# Altium schematic sheet Monitait.SchDoc
size 762 x 508 mm
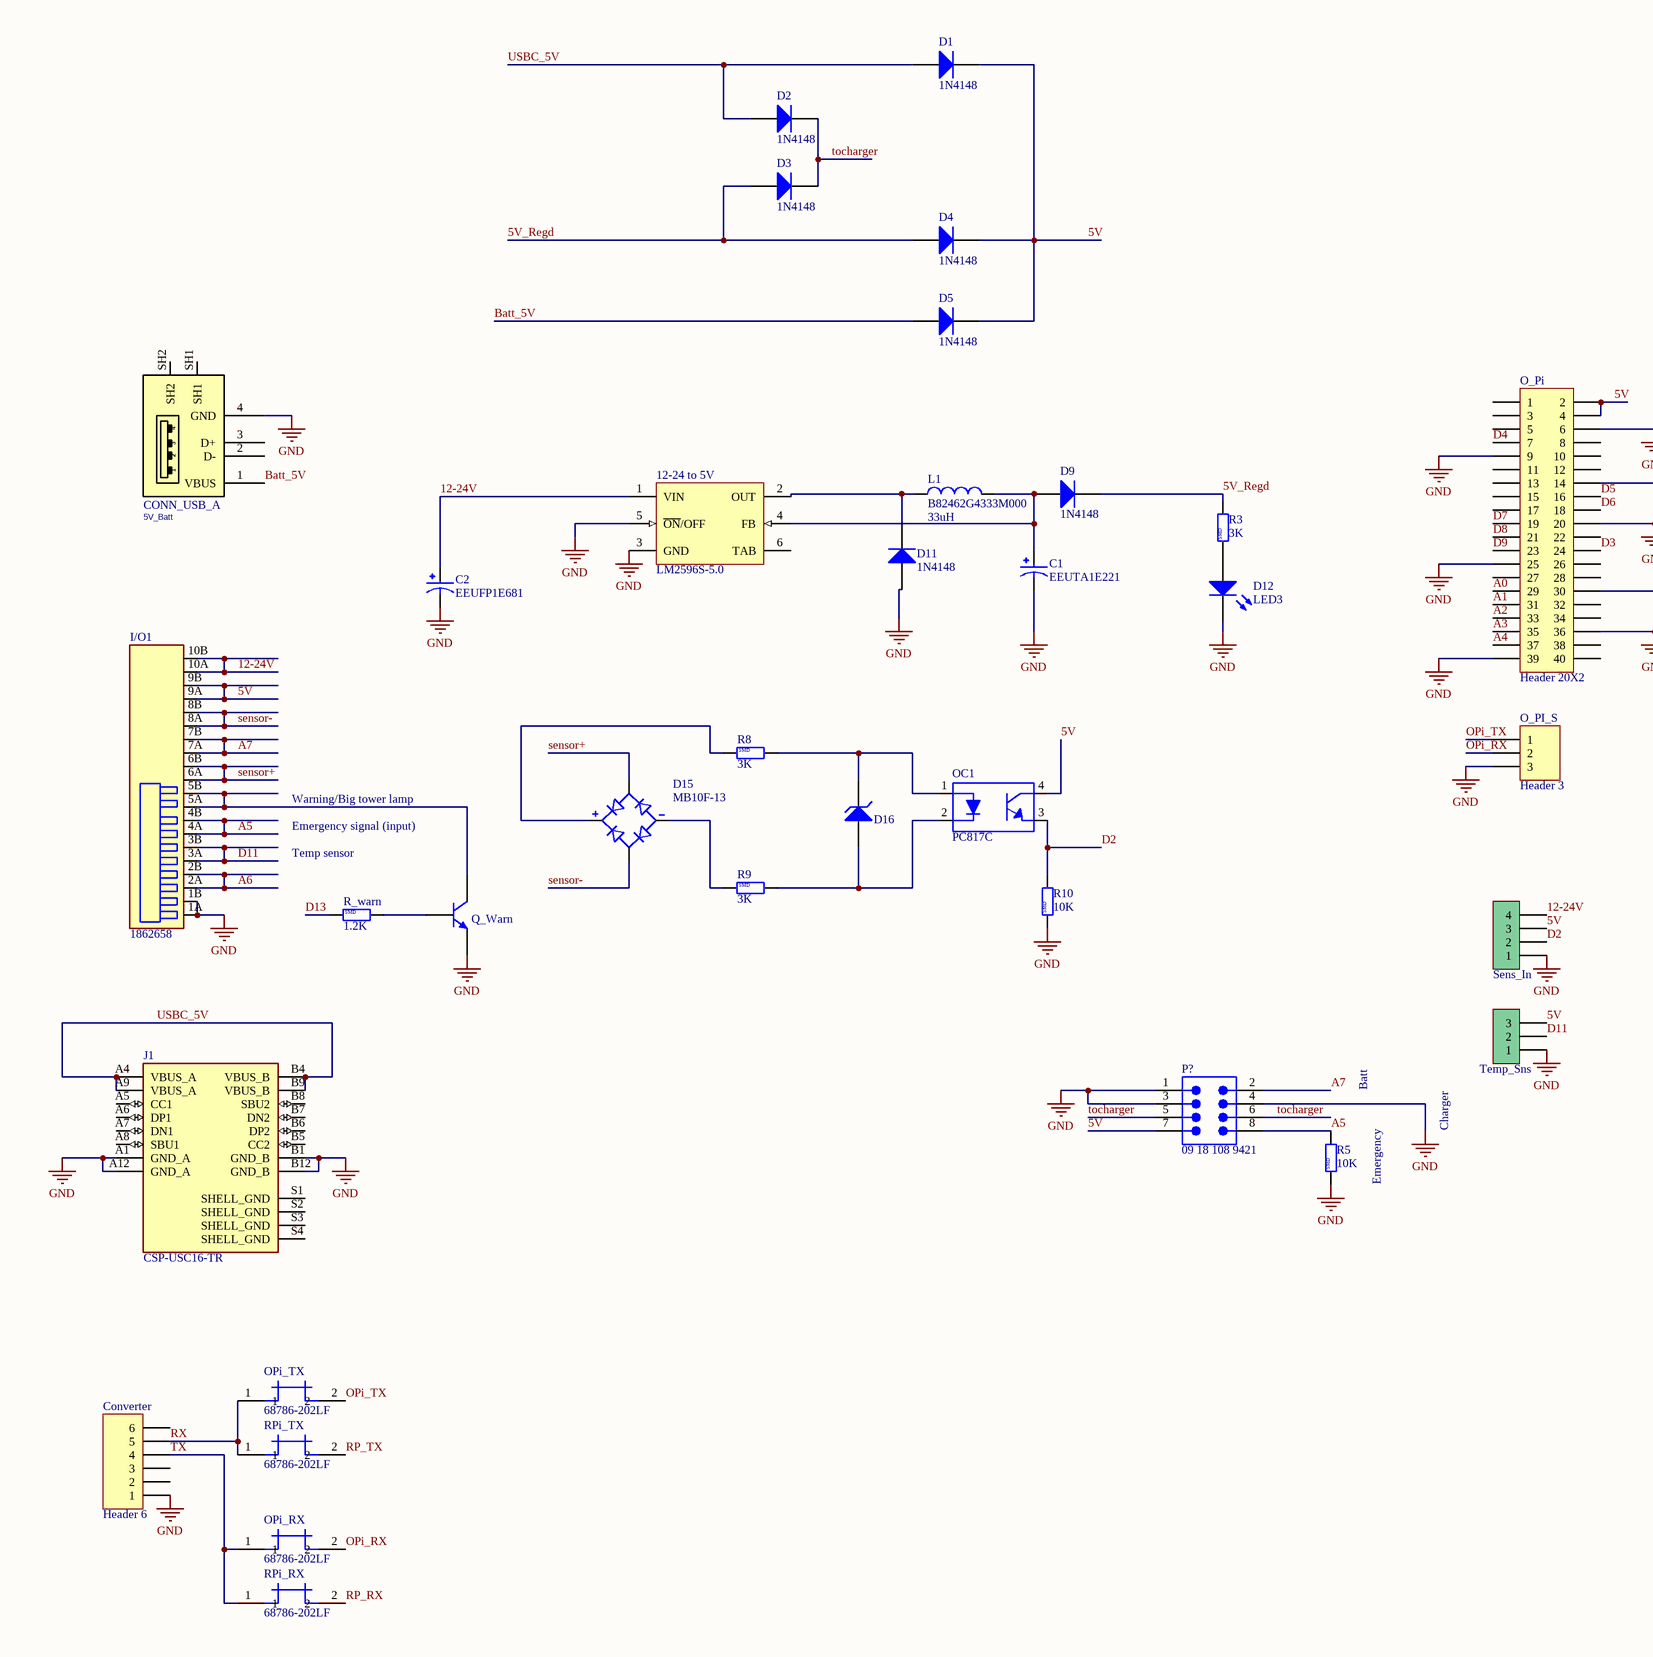
[diagram p0: Monitait.SchDoc, left]
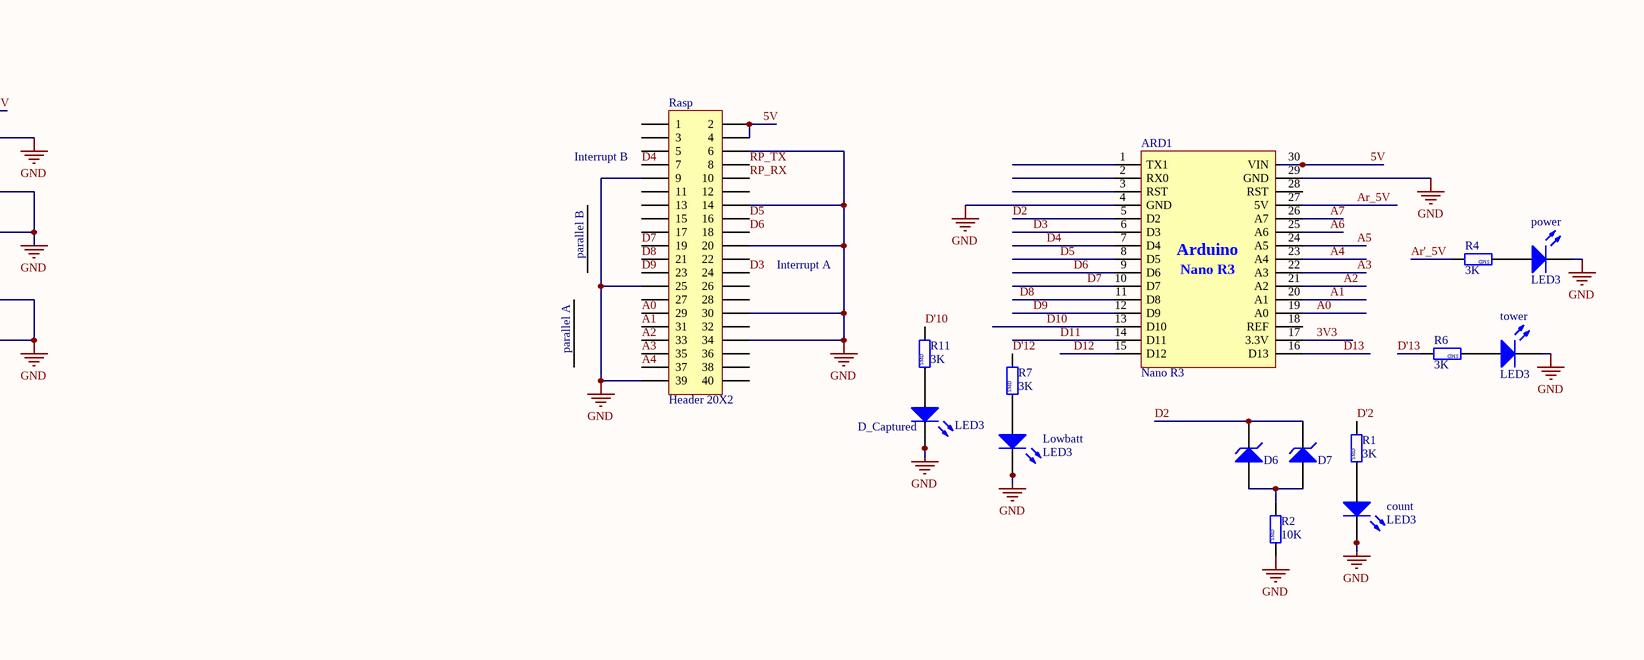
[diagram p1: Monitait.SchDoc, right]

## Parts
5V_Batt  CONN_USB_A  [USB_A_REC_ST]
12-24_to_5V  LM2596S-5.0  [TS5B_N]
ARD1  Nano R3  [Arduino_Nano_R3]
C1  EEUTA1E221  [CAPPRD500W60D1000H1250]
C2  EEUFP1E681  [CAPPRD500W60D1000H1600]
Converter  Header 6  [HDR1X6]
count  LED3  [RES 0805 (2012X06L)]
D1  1N4148  [LL4148]
D2  1N4148  [LL4148]
D3  1N4148  [LL4148]
D4  1N4148  [LL4148]
D5  1N4148  [LL4148]
D6  Diode Zener  [MINI MELF]  (value not drawn)
D7  Diode Zener  [Diode 1W]  (value not drawn)
D9  1N4148  [LL4148]
D11  1N4148  [LL4148]
D12  LED3  [RES 0805 (2012X06L)]
D15  MB10F-13  [DIOB_MB10F-13]
D16  Diode Zener  [MINI MELF]  (value not drawn)
D_Captured  LED3  [RES 0805 (2012X06L)]
I/O1  1862658  [PHOENIX_1862658]
J1  CSP-USC16-TR  [VALCON_CSP-USC16-TR]
L1  B82462G4333M000  value 33uH  [B82462G4]
Lowbatt  LED3  [RES 0805 (2012X06L)]
O_Pi  Header 20X2  [HDR2X20]
O_PI_S  Header 3  [HDR1X3]
OC1  PC817C  [SOP4]
OPi_RX  68786-202LF  [HDR1X2]
OPi_TX  68786-202LF  [HDR1X2]
P?  09 18 108 9421  [9181089421]
power  LED3  [RES 0805 (2012X06L)]
Q_Warn  BD135-37-39  [TO-126 (SOT32) Gold PCB]  (value not drawn)
R1  3K  [RES 0805 (2012X06L)]
R2  10K  [RES 0805 (2012X06L)]
R3  3K  [RES 0805 (2012X06L)]
R4  3K  [RES 0805 (2012X06L)]
R5  10K  [RES 0805 (2012X06L)]
R6  3K  [RES 0805 (2012X06L)]
R7  3K  [RES 0805 (2012X06L)]
R8  3K  [RES 0805 (2012X06L)]
R9  3K  [RES 0805 (2012X06L)]
R10  10K  [RES 0805 (2012X06L)]
R11  3K  [RES 0805 (2012X06L)]
R_warn  1.2K  [RES 0805 (2012X06L)]
Rasp  Header 20X2  [HDR2X20]
RPi_RX  68786-202LF  [HDR1X2]
RPi_TX  68786-202LF  [HDR1X2]
Sens_In  Phoenix terminal  [phoenix terminal 4]  (value not drawn)
Temp_Sns  Phoenix terminal  [phoenix terminal 3]  (value not drawn)
tower  LED3  [RES 0805 (2012X06L)]

## Nets
GND: 5V_Batt.4(GND) 12-24_to_5V.3(GND) 12-24_to_5V.5(~{ON}/OFF) ARD1.4(GND) ARD1.29(GND) C1.N C2.N Converter.1 count.2(K) D11.1(A) D12.2(K) D_Captured.2(K) I/O1.1A I/O1.1B J1.A1(GND_A) J1.A12(GND_A) J1.B1(GND_B) J1.B12(GND_B) Lowbatt.2(K) O_Pi.6 O_Pi.9 O_Pi.14 O_Pi.20 O_Pi.25 O_Pi.30 O_Pi.36 O_Pi.39 O_PI_S.3 P?.1 P?.3 P?.4 power.2(K) Q_Warn.1(E) R2.1 R5.1 R10.1 Rasp.6 Rasp.9 Rasp.14 Rasp.20 Rasp.25 Rasp.30 Rasp.34 Rasp.39 Sens_In.1 Temp_Sns.1 tower.2(K)
3V3: ARD1.17(3.3V)
5V: ARD1.30(VIN) D1.2(K) D4.2(K) D5.2(K) I/O1.9A I/O1.9B O_Pi.2 O_Pi.4 OC1.4 P?.7 Rasp.2 Rasp.4 Sens_In.3 Temp_Sns.3
5V_Regd: D3.1(A) D4.1(A) D9.2(K) R3.2
12-24V: 12-24_to_5V.1(VIN) C2.P I/O1.10A I/O1.10B Sens_In.4
A0: ARD1.19(A0) O_Pi.29 Rasp.29
A1: ARD1.20(A1) O_Pi.31 Rasp.31
A2: ARD1.21(A2) O_Pi.33 Rasp.33
A3: ARD1.22(A3) O_Pi.35 Rasp.35
A4: ARD1.23(A4) O_Pi.37 Rasp.37
A5: ARD1.24(A5) I/O1.4A I/O1.4B P?.8 R5.2
A6: ARD1.25(A6) I/O1.2A I/O1.2B
A7: ARD1.26(A7) I/O1.7A I/O1.7B P?.2
Ar'_5V: R4.2
Ar_5V: ARD1.27(5V)
Batt_5V: 5V_Batt.1(VBUS) D5.1(A)
D2: ARD1.5(D2) D6.2(K) D7.2(K) OC1.3 R10.2 Sens_In.2
D3: ARD1.6(D3) O_Pi.24 Rasp.24
D4: ARD1.7(D4) O_Pi.7 Rasp.7
D5: ARD1.8(D5) O_Pi.16 Rasp.16
D6: ARD1.9(D6) O_Pi.18 Rasp.18
D7: ARD1.10(D7) O_Pi.19 Rasp.19
D8: ARD1.11(D8) O_Pi.21 Rasp.21
D9: ARD1.12(D9) O_Pi.23 Rasp.23
D10: ARD1.13(D10)
D11: ARD1.14(D11) I/O1.3A I/O1.3B Temp_Sns.2
D12: ARD1.15(D12)
D13: ARD1.16(D13) R_warn.1
D'2: R1.2
D'10: R11.2
D'12: R7.2
D'13: R6.2
OPi_RX: O_PI_S.2 OPi_RX.2
OPi_TX: O_PI_S.1 OPi_TX.2
RP_RX: Rasp.10 RPi_RX.2
RP_TX: Rasp.8 RPi_TX.2
RX: Converter.5 OPi_TX.1 RPi_TX.1
sensor+: D15.2(AC1) I/O1.6A I/O1.6B
sensor-: D15.4(AC2) I/O1.8A I/O1.8B
tocharger: D2.2(K) D3.2(K) P?.5 P?.6
TX: Converter.4 OPi_RX.1 RPi_RX.1
USBC_5V: D1.1(A) D2.1(A) J1.A4(VBUS_A) J1.A9(VBUS_A) J1.B4(VBUS_B) J1.B9(VBUS_B)
Net12-24_to_5V_2: 12-24_to_5V.2(OUT) D11.2(K) L1.1
Net12-24_to_5V_4: 12-24_to_5V.4(FB) C1.P D9.1(A) L1.2
Netcount_1: count.1(A) R1.1
NetD6_1: D6.1(A) D7.1(A) R2.2
NetD12_1: D12.1(A) R3.1
NetD15_1: D15.1(POS) R8.1
NetD15_3: D15.3(NEG) R9.1
NetD16_1: D16.1(A) OC1.2 R9.2
NetD16_2: D16.2(K) OC1.1 R8.2
NetD_Captured_1: D_Captured.1(A) R11.1
NetI/O1_5A: I/O1.5A I/O1.5B Q_Warn.2(C)
NetLowbatt_1: Lowbatt.1(A) R7.1
Netpower_1: power.1(A) R4.1
NetQ_Warn_3: Q_Warn.3(B) R_warn.2
NetR6_1: R6.1 tower.1(A)

Not connected (* = marked no-connect by the designer): 5V_Batt 2(D-) 3(D+) SH1 SH2; 12-24_to_5V 6(TAB); ARD1 1(TX1) 2(RX0) 3(RST) 18(REF) 28(RST); Converter 2 3 6; J1 A5(CC1) A6(DP1) A7(DN1) A8(SBU1) B5(CC2) B6(DP2) B7(DN2) B8(SBU2) S1(SHELL_GND) S2(SHELL_GND) S3(SHELL_GND) S4(SHELL_GND); O_Pi 1 3 5 8 10 11 12 13 15 17 22 26 27 28 32 34 38 40; Rasp 1 3 5 11 12 13 15 17 22 26 27 28 32 36 38 40

## Notes on the sheet
- (near Rasp) Interrupt B
- parallel B
- Interrupt A
- parallel A
- Warning/Big tower lamp
- Emergency signal (input)
- Temp sensor
- Batt
- Charger
- (near R5) Emergency
- (in symbol Arduino Nano R3) Arduino
- (in symbol Resistor SMD) SMD

## Library data of the parts
5V_Batt = USB_A_REC_ST: CONN, USB, A, RECEPTACLE, STRAIGHT, THD; VALUE: CONN_USB_A
12-24_to_5V = LM2596S-5.0: SIMPLE SWITCHER® Power Converter 150 KHz 3A Step-Down Voltage Regulator, 5-pin TO-263; Manufacturer: National Semiconductor; PackageTopMarking: NSUZXYTTE#*LM2596S*-5.0 P+; PowerWise: N; Published: 4-Dec-2008; DatasheetVersion: May-2002; PackageVersion: revD, Apr-2005; PackageReference: TS5B; Publisher: Altium Limited; PackageDescription: TO-263, Molded, .400 x .390 x .180in, 5 Lead, .067in Pitch, Surface Mount; Supplier 1: Farnell; Supplier Part Number 1: 1214546; PartNumber: LM2596S-5.0; RoHS: N; PinCount: 5; CompType: Switcher; Code_JEDEC: MO-169-AB; ComponentLink1Description: LM2596 Datasheet; ComponentLink1URL: http://www.national.com/ds/LM/LM2596.pdf; ComponentLink2Description: LM2596 Web Page; ComponentLink2URL: http://www.national.com/pf/LM/LM2596.html; ComponentLink3Description: TS5B Package Page; ComponentLink3URL: http://www.national.com/packaging/folders/ts5b.html
ARD1 = Arduino Nano R3
C1 = EEUTA1E221: CAP ALUM 220UF 20% 25V RADIAL; MF: Panasonic Electronic Components; MP: EEU-TA1E221; Package: RADIAL-2 Panasonic; Check_prices: https://www.snapeda.com/parts/EEU-TA1E221/Panasonic/view-part/5528202/?ref=eda; Purchase-URL: https://pricing.snapeda.com/search/part/EEU-TA1E221/?ref=eda; SnapEDA_Link: https://www.snapeda.com/parts/EEU-TA1E221/Panasonic/view-part/5528202/?ref=snap; Price: None; Availability: In Stock; Value: *
C2 = EEUFP1E681: CAP ALUM 680UF 20% 25V RADIAL; MF: Panasonic; MP: EEUFP1E681; Package: RADIAL-2 Panasonic; Check_prices: https://www.snapeda.com/parts/EEUFP1E681/Panasonic/view-part/5782468/?ref=eda; Digi-Key_Part_Number: P123955CT-ND; SnapEDA_Link: https://www.snapeda.com/parts/EEUFP1E681/Panasonic/view-part/5782468/?ref=snap; Value: *
Converter = Header 6: Header, 6-Pin; LatestRevisionDate: 17-Jul-2002; LatestRevisionNote: Re-released for DXP Platform.; Publisher: Altium Limited
count D12 D_Captured Lowbatt power tower = LED3: Typical BLUE SiC LED; Published: 8-Jun-2000; LatestRevisionDate: 17-Dec-2003; LatestRevisionNote: PCB Footprint replaced.; DatasheetVersion: 16-Apr-2002; PackageVersion: 16-Apr-2002; PackageReference: 3.5X2.8X1.9; Publisher: Altium Limited; PackageDescription: SM LED; 2 C-Bend Leads; Body 3.5 x 2.8 x 1.9 mm, inc leads (LxWxH typ)
D1-D5 D9 D11 = Diode 1N4148: High Conductance Fast Diode; Published: 8-Jun-2000; LatestRevisionDate: 17-Jul-2002; LatestRevisionNote: Re-released for DXP Platform.; DatasheetVersion: 1997; PackageReference: DO-35; Publisher: Altium Limited; PackageDescription: Diode, Axial; Body 3.8 x 1.9 mm (LxDia. max), Lead Dia. 0.53 mm (max); Code_JEDEC: DO-204-AH; ComponentLink1Description: Manufacturer Link; ComponentLink1URL: http://www.fairchildsemi.com/; ComponentLink2Description: Datasheet; ComponentLink2URL: http://www.fairchildsemi.com/ds/1N%2F1N4148.pdf
D6 D7 D16 = Diode Zener: Zener Diode; Designer: Saeid Jorablo; Company: E.P.I.L; Voltage: 3.3 V; Design Date: 2011/11/02
D15 = MB10F-13: Bridge Rectifier Single Phase Standard 1kV Surface Mount MBF; Price: None; Package: None; Availability: Unavailable; MP: MB10F-13; Value: *
I/O1 = 1862658: 10 Position Terminal Block Header, Female Sockets 0.150 _3.81mm_ 90Â°, Right Angle Through Hole; MF: Phoenix Contact; Package: None; Value: *; SnapEDA_Link: https://www.snapeda.com/parts/1862658/Phoenix%20Contact/view-part/424969/?ref=snap; Availability: Unavailable; MP: 1862658; Price: None
J1 = CSP-USC16-TR: CSP-USC16-TR Valcon USB Type C Surface Mount PCB Socket; Package: None; Purchase-URL: https://pricing.snapeda.com/search/part/CSP-USC16-TR/?ref=eda; MP: CSP-USC16-TR; Check_prices: https://www.snapeda.com/parts/CSP-USC16-TR/Valcon/view-part/4783629/?ref=eda; MF: Valcon; Value: *; Availability: No availability data; Price: None; SnapEDA_Link: https://www.snapeda.com/parts/CSP-USC16-TR/Valcon/view-part/4783629/?ref=snap
L1 = B82462G4333M000: SMT Power Inductor; Size 6.3×6.3×3.0mm, ±20% Tolerance, 33uH, 0.85A; PCB_Layout: Complies with manufacturer's recommendation.; Published: 26-Sep-2008; DatasheetVersion: Mar-2008; PackageVersion: Mar-2008; PackageReference: B82462G4; Publisher: Altium Limited; PackageDescription: SM Power Inductor; 2 Leads; Body 6.3 x 6.3 x 3.0 mm (LxWxH); ComponentLink1Description: Manufacturer Link; ComponentLink1URL: http://www.epcos.com/; ComponentLink2Description: Datasheet; ComponentLink2URL: http://www.epcos.com/inf/30/db/ind_2008/b82462g4.pdf
O_Pi = Header 20X2: Header, 20-Pin, Dual row; pin to pad: 1>39 2>40 3>37 4>38 5>35 6>36 7>33 8>34 9>31 10>32 11>29 12>30 13>27 14>28 15>25 16>26 17>23 18>24 19>21 20>22 21>19 22>20 23>17 24>18 25>15 26>16 27>13 28>14 29>11 30>12 31>9 32>10 33>7 34>8 35>5 36>6 37>3 38>4 39>1 40>2; LatestRevisionDate: 17-Jul-2002; LatestRevisionNote: Re-released for DXP Platform.; Publisher: Altium Limited
O_PI_S = Header 3: Header, 3-Pin; LatestRevisionDate: 17-Jul-2002; LatestRevisionNote: Re-released for DXP Platform.; Publisher: Altium Limited
OC1 = PC817C: Optoisolator Transistor Output 5000Vrms 1 Channel 4-DIP; MF: Taiwan Semiconductor; Value: *; Availability: Unavailable; SnapEDA_Link: https://www.snapeda.com/parts/PC817C/Taiwan%20Semiconductor%20Corporation/view-part/2816187/?ref=snap; Package: DIP-4 Taiwan Semiconductor; MP: PC817C; Price: None
OPi_RX OPi_TX RPi_RX RPi_TX = 68786-202LF: Low Profile Jumper , Single Row, 2 Positions, 2.54mm (0.100in) Pitch; MF: FCI; SnapEDA_Link: https://www.snapeda.com/parts/68786-202LF/Framatome%20Connectors/view-part/4792913/?ref=snap; MP: 68786-202LF; Price: None; Package: None; Value: *; Check_prices: https://www.snapeda.com/parts/68786-202LF/Framatome%20Connectors/view-part/4792913/?ref=eda; Purchase-URL: https://pricing.snapeda.com/search/part/68786-202LF/?ref=eda; Availability: Good
P? = 09 18 108 9421: Flat Cable Connector (IDC), PCB Transition Connector, 2 Rows, Kinked Solder Pin, 8 Contacts; PCB_Layout: Complies with manufacturer's recommendation.; DrillSize: Corresponds to nominal value.; Published: 15-Nov-2004; PackageDocument: 16-Sep-2003; PackageReference: 9181089421; Publisher: Altium Limited; ComponentLink1Description: Manufacturer Link; ComponentLink1URL: http://www.harting.com/; ComponentLink2Description: Packaging Specification; ComponentLink2URL: http://www.harkis.harting.com/_sek/pdf/TB_09181089421_BL01_R31541.pdf
Q_Warn = BD135-37-39: NPN Transistor
R1-R11 R_warn = Resistor SMD: Resistor; Published: 8-Jun-2000; LatestRevisionDate: 17-Jul-2002; LatestRevisionNote: Re-released for DXP Platform.; PackageReference: AXIAL-0.4; Publisher: Altium Limited; PackageDescription: Axial Device, Thru-Hole; 2 Leads; 0.4 in Pin Spacing
  R1 R3 R4 R6-R9 R11: Value: 3K
  R2 R5 R10: Value: 10K
  R_warn: Value: 1.2K
Rasp = Header 20X2: Header, 20-Pin, Dual row; pin to pad: 1>2 2>1 3>4 4>3 5>6 6>5 7>8 8>7 9>10 10>9 11>12 12>11 13>14 14>13 15>16 16>15 17>18 18>17 19>20 20>19 21>22 22>21 23>24 24>23 25>26 26>25 27>28 28>27 29>30 30>29 31>32 32>31 33>34 34>33 35>36 36>35 37>38 38>37 39>40 40>39; LatestRevisionDate: 17-Jul-2002; LatestRevisionNote: Re-released for DXP Platform.; Publisher: Altium Limited
Sens_In = Phoenix terminal 4: Terminal 4 Pin; Designer: Seyed Mohsen Ghasemain; E-mail: picpars@gmail.com; ComponentLinkURL: www.picpars.com
Temp_Sns = Phoenix terminal 3: Terminal 3 Pin; Designer: Seyed Mohsen Ghasemain; E-mail: picpars@gmail.com; ComponentLinkURL: www.picpars.com